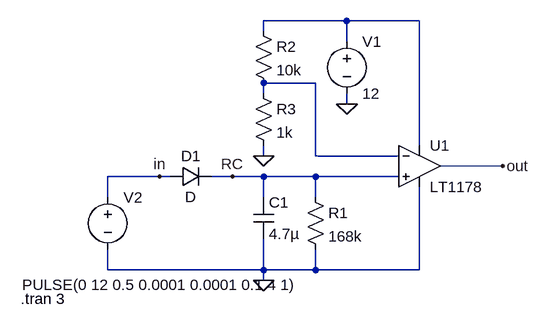
[diagram p0: schematic Opamp_amp.asc]
Opamp_amp.asc, the LTspice schematic file:
Version 4
SHEET 1 880 680
WIRE 368 -160 240 -160
WIRE 480 -160 368 -160
WIRE 240 -144 240 -160
WIRE 368 -128 368 -160
WIRE 320 -64 240 -64
WIRE 240 -48 240 -64
WIRE 368 -32 368 -48
WIRE 480 32 480 -160
WIRE 240 48 240 32
WIRE 320 48 320 -64
WIRE 448 48 320 48
WIRE 608 64 512 64
WIRE 80 80 0 80
WIRE 96 80 80 80
WIRE 192 80 160 80
WIRE 240 80 192 80
WIRE 320 80 240 80
WIRE 448 80 320 80
WIRE 0 112 0 80
WIRE 240 112 240 80
WIRE 320 112 320 80
WIRE 0 224 0 192
WIRE 240 224 240 176
WIRE 240 224 0 224
WIRE 320 224 320 192
WIRE 320 224 240 224
WIRE 480 224 480 96
WIRE 480 224 320 224
WIRE 240 240 240 224
FLAG 240 240 0
FLAG 368 -32 0
FLAG 240 48 0
FLAG 608 64 out
FLAG 80 80 in
FLAG 192 80 RC
SYMBOL diode 96 96 R270
WINDOW 0 32 32 VTop 2
WINDOW 3 0 32 VBottom 2
SYMATTR InstName D1
SYMBOL cap 224 112 R0
SYMATTR InstName C1
SYMATTR Value 4.7µ
SYMBOL res 304 96 R0
SYMATTR InstName R1
SYMATTR Value 168k
SYMBOL Opamps\\LT1178 480 0 R0
SYMATTR InstName U1
SYMBOL voltage 368 -144 R0
WINDOW 123 0 0 Left 0
WINDOW 39 0 0 Left 0
SYMATTR InstName V1
SYMATTR Value 12
SYMBOL res 224 -160 R0
SYMATTR InstName R2
SYMATTR Value 10k
SYMBOL res 224 -64 R0
SYMATTR InstName R3
SYMATTR Value 1k
SYMBOL voltage 0 96 R0
WINDOW 3 -132 151 Left 2
WINDOW 123 0 0 Left 0
WINDOW 39 0 0 Left 0
SYMATTR InstName V2
SYMATTR Value PULSE(0 12 0.5 0.0001 0.0001 0.1 4 1)
TEXT -134 268 Left 2 !.tran 3

The netlist it stands for:
* Opamp_amp.asc
D1 in RC D
C1 RC 0 4.7µ
R1 RC 0 168k
XU1 RC N002 N001 0 out LT1178  ; pins In+ In- V+ V- OUT
V1 N001 0 12
R2 N001 N002 10k
R3 N002 0 1k
V2 in 0 PULSE(0 12 0.5 0.0001 0.0001 0.1 4 1)
.model D D
.lib standard.dio
.tran 3
.backanno
.end